# Altium project Spectre-Spectrum-Analyer.PrjPcb
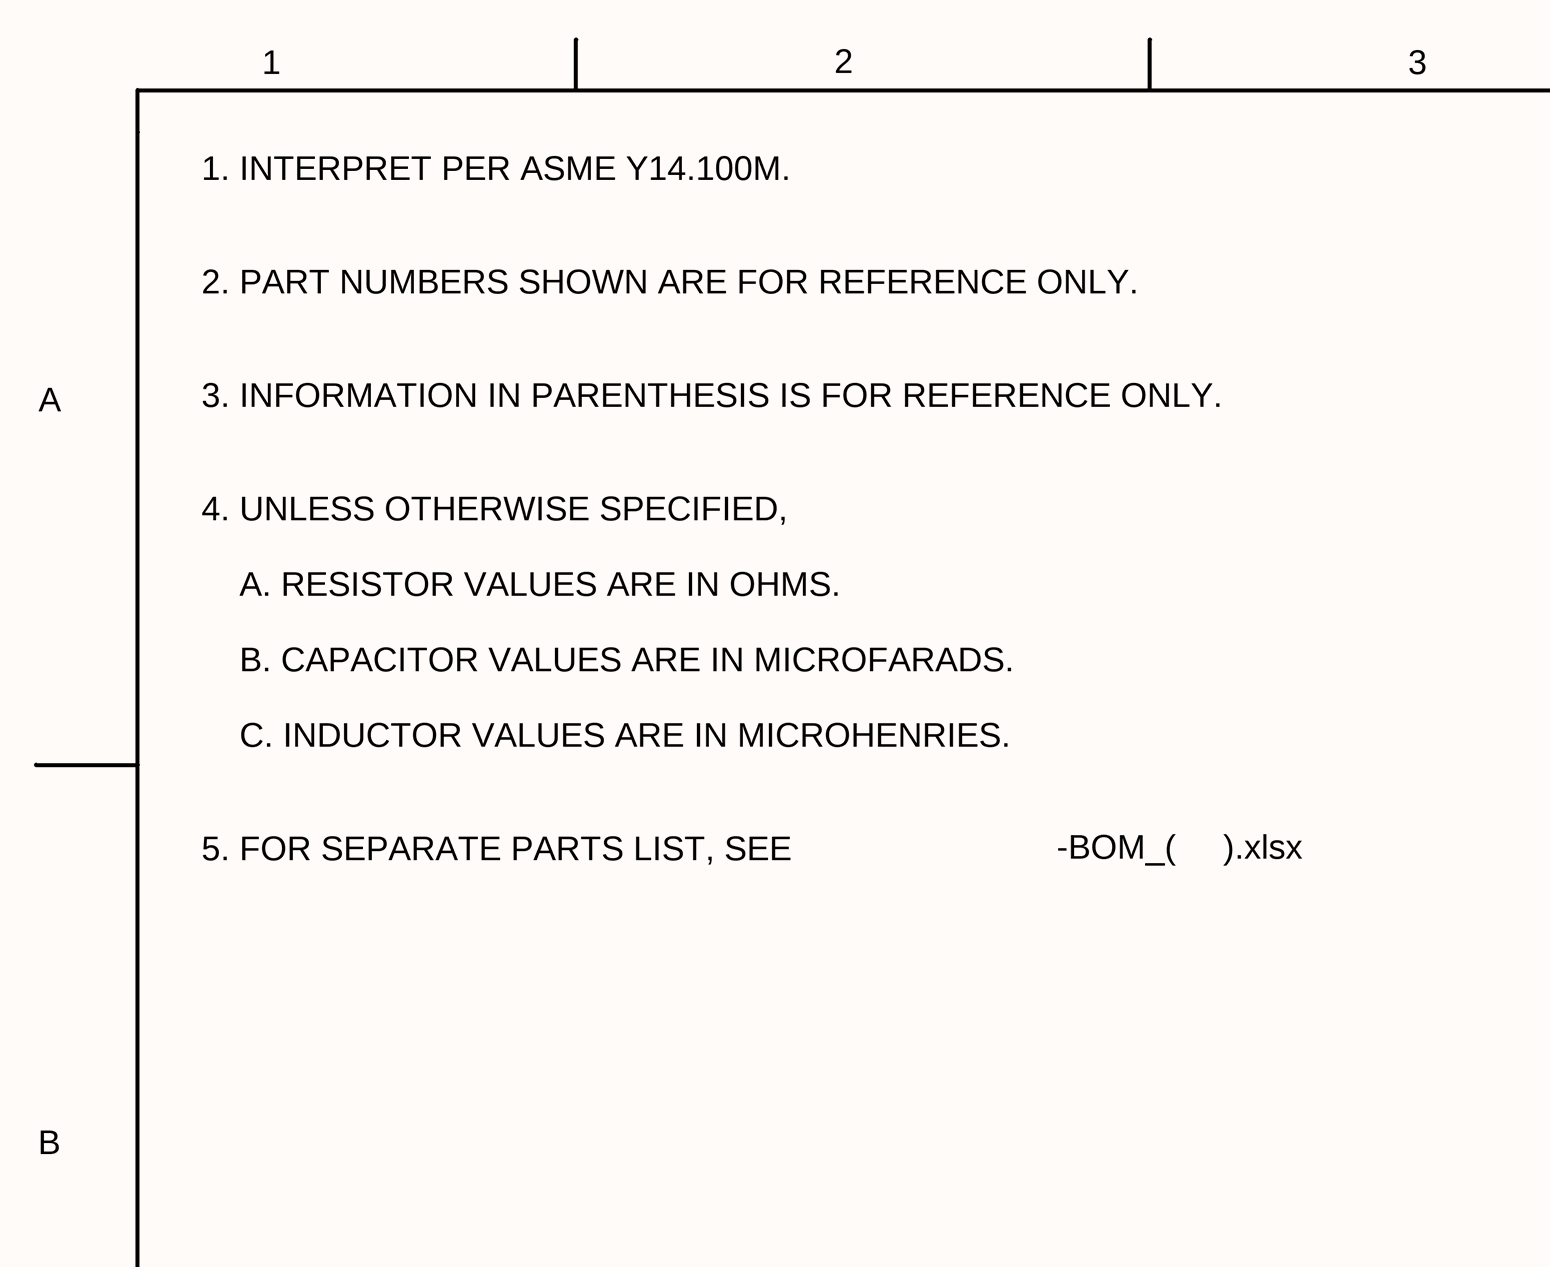
[diagram p0: Spectre-SCH_SH1_(rev).SchDoc, top left]
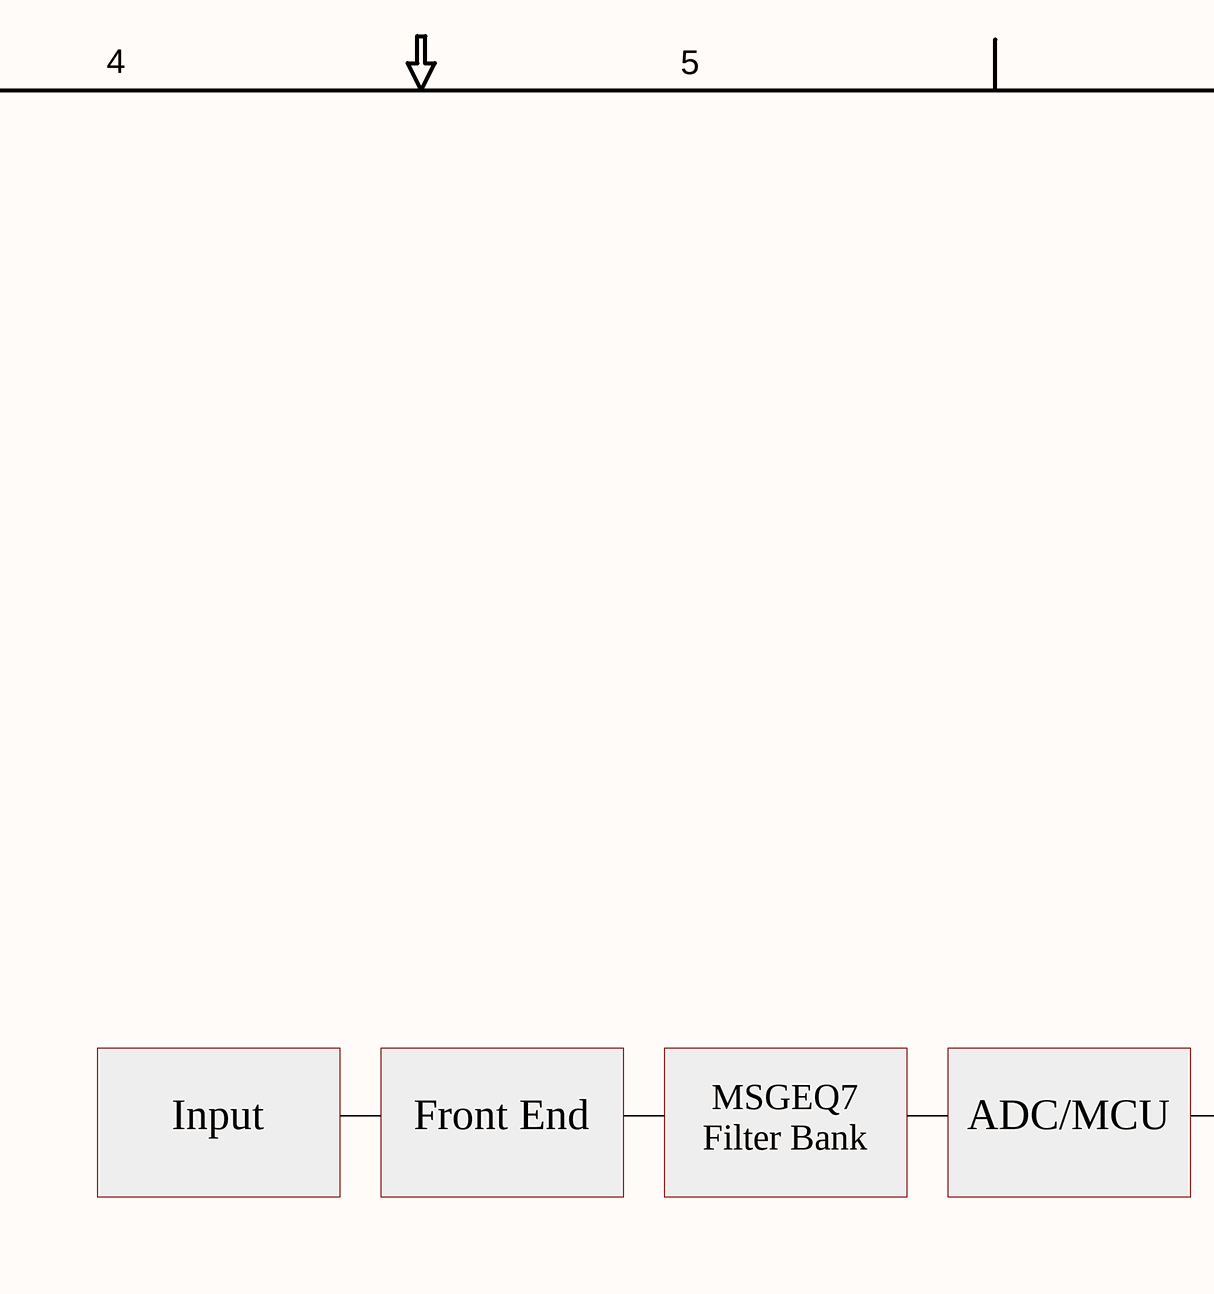
[diagram p1: Spectre-SCH_SH1_(rev).SchDoc, top middle]
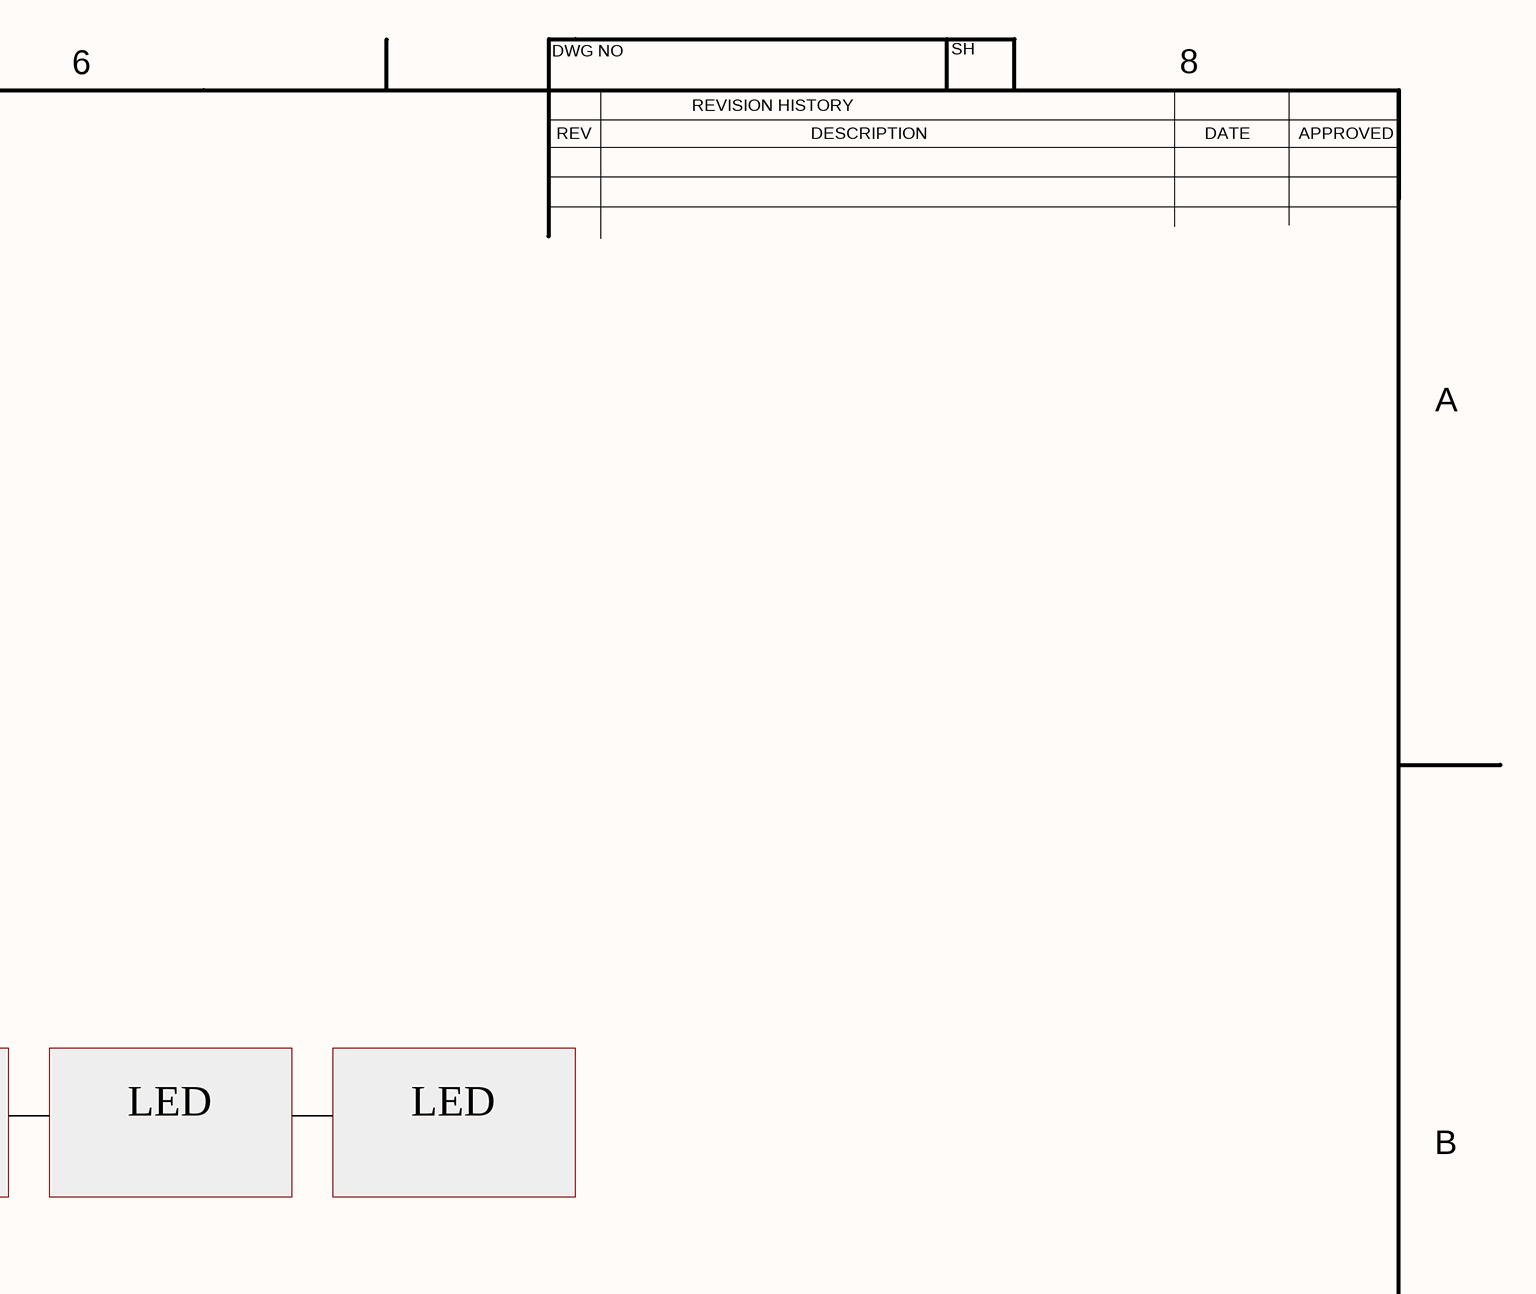
[diagram p2: Spectre-SCH_SH1_(rev).SchDoc, top right]
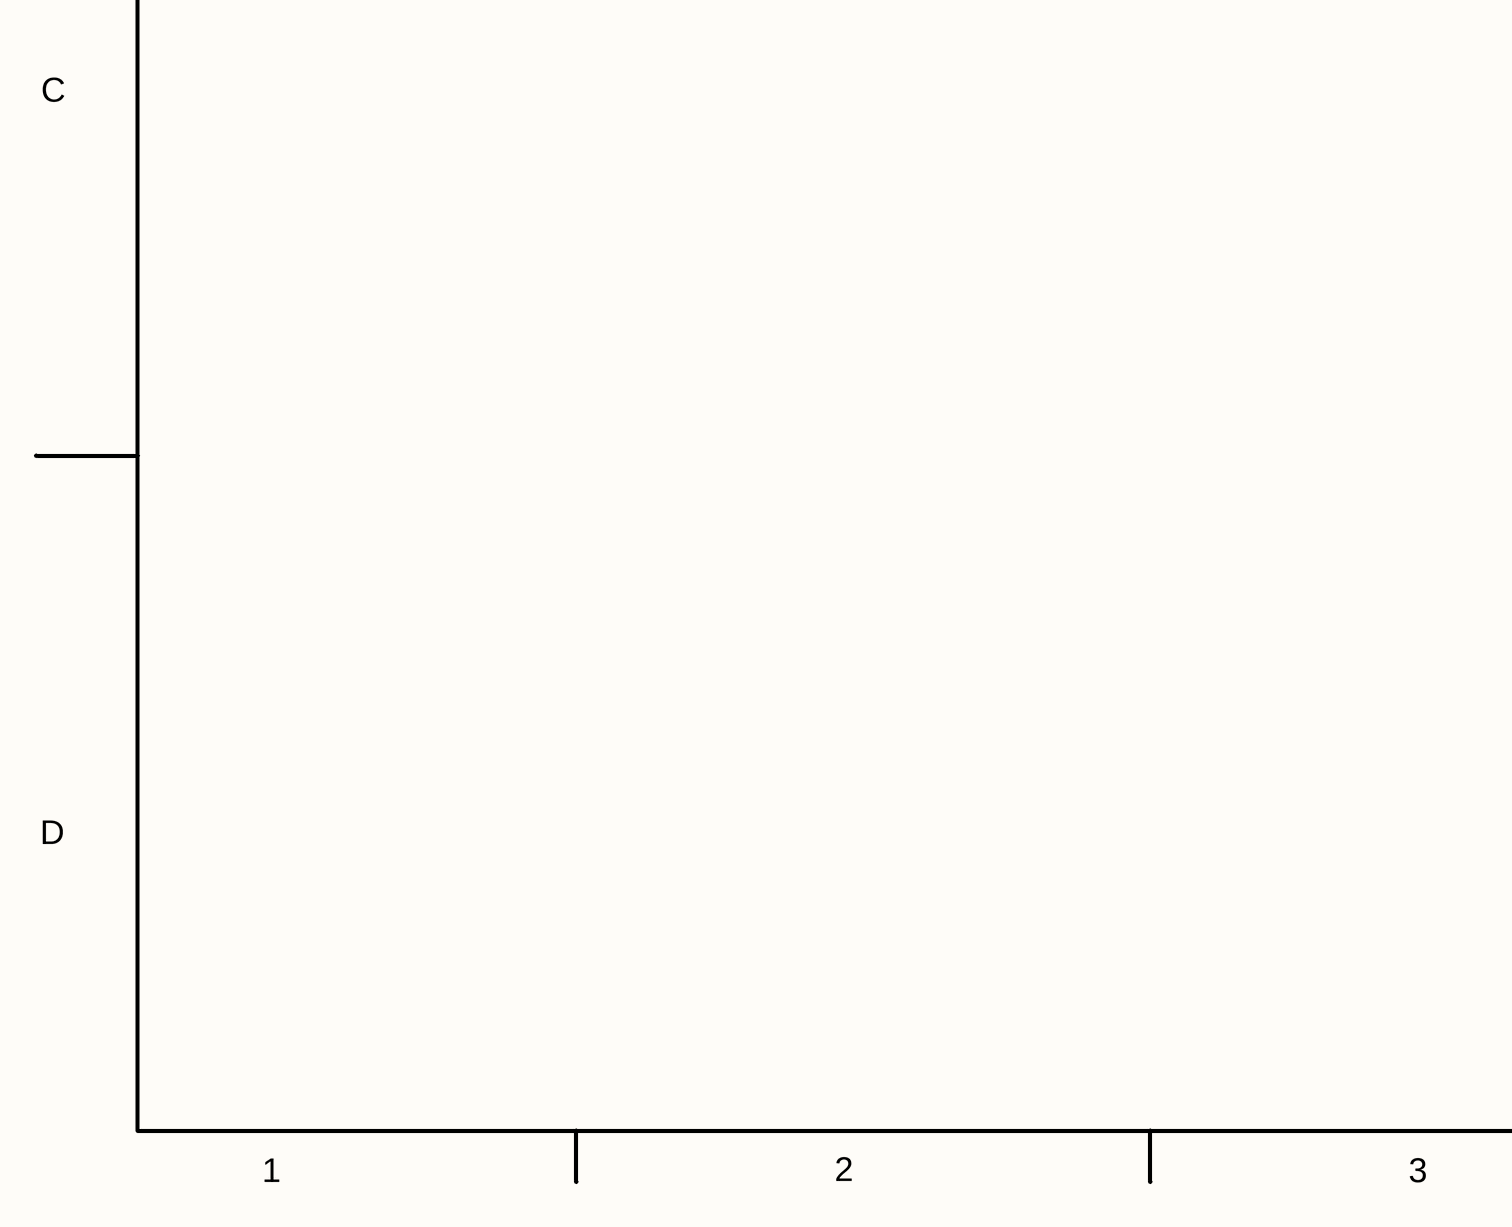
[diagram p3: Spectre-SCH_SH1_(rev).SchDoc, bottom left]
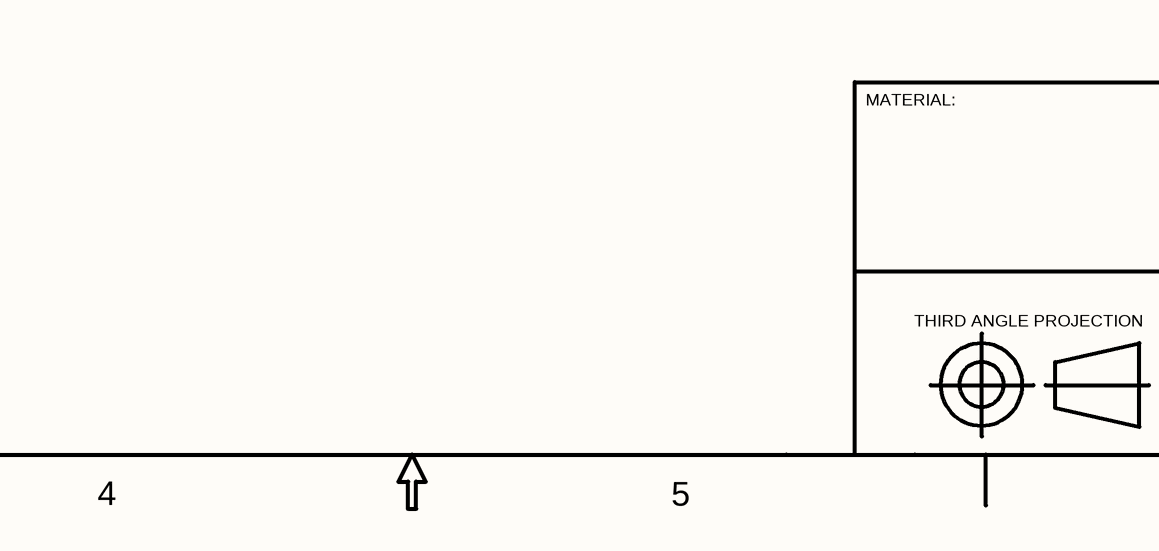
[diagram p4: Spectre-SCH_SH1_(rev).SchDoc, bottom middle]
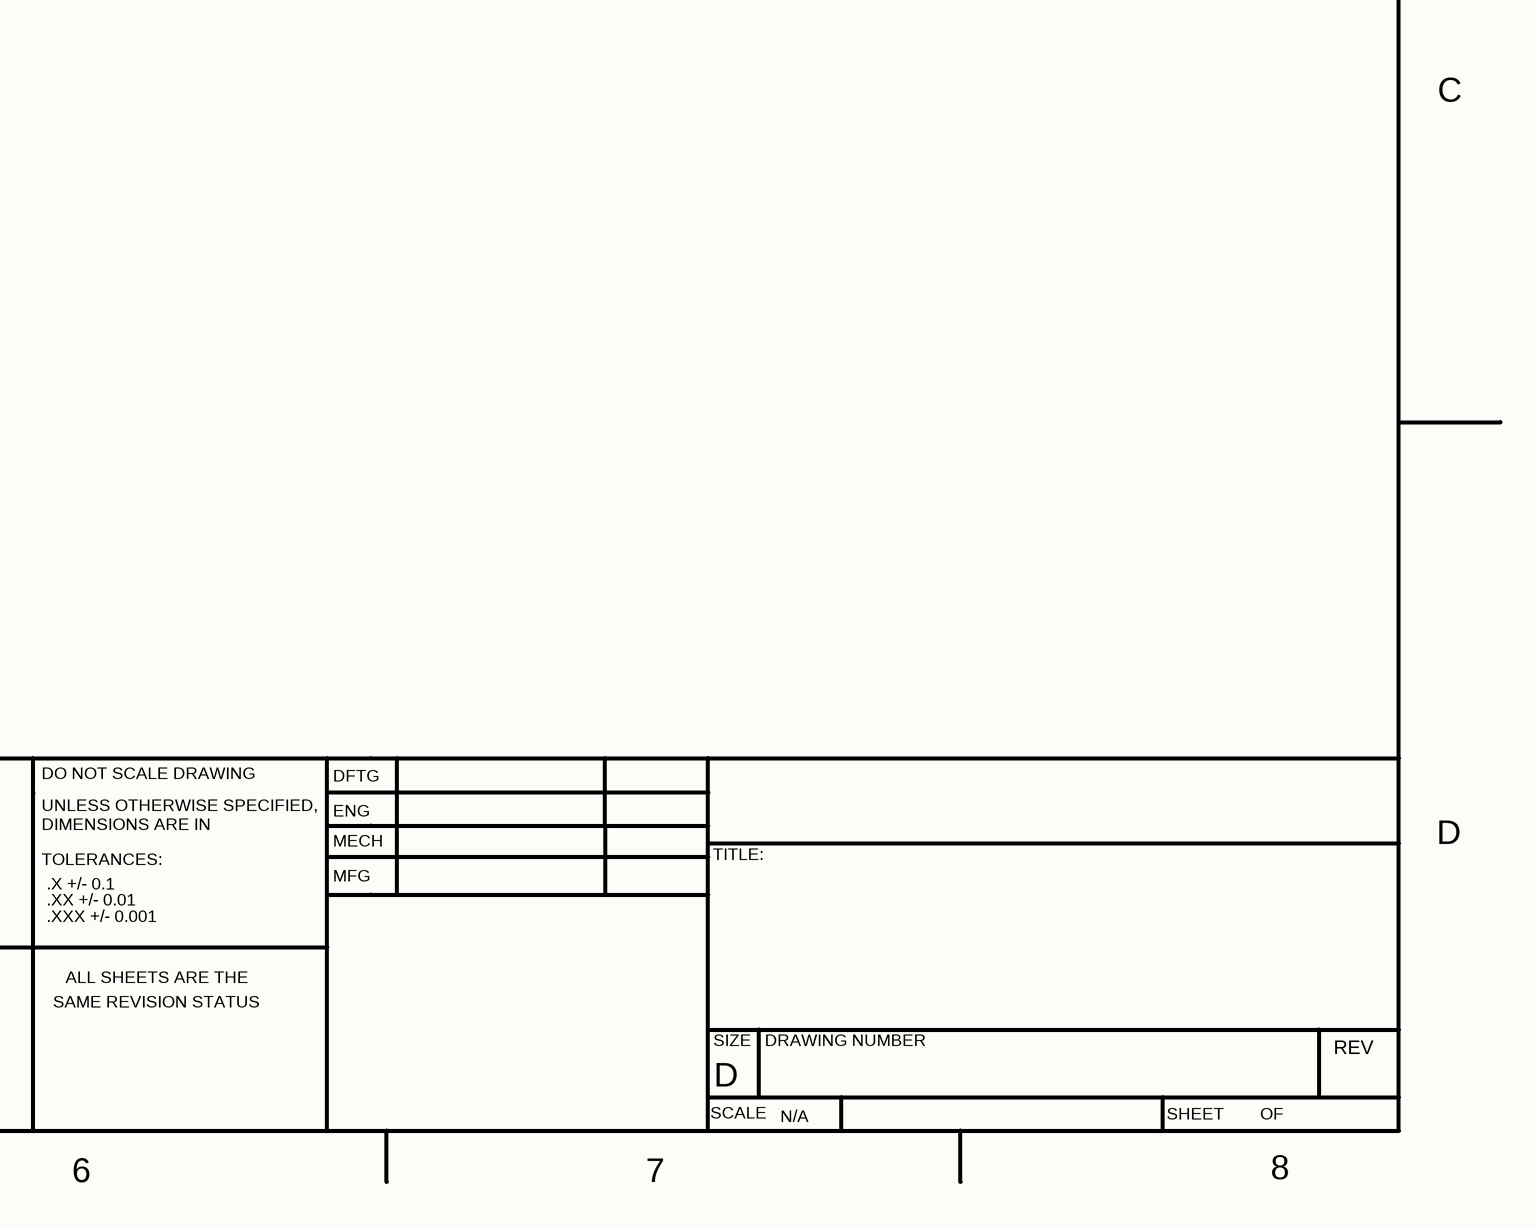
[diagram p5: Spectre-SCH_SH1_(rev).SchDoc, bottom right]
Company: -; DateDftg: -; DateEng: 01/08/22; DocNumber: Spectre; DocNumberPCB: SpectrePCB; Hist1Appr: 11/07/21; Hist1Date: 09/10/21; Hist1Desc: -; Hist1Rev: A; Hist2Appr: -; Hist2Date: -; Hist2Desc: -; Hist2Rev: -; Hist3Appr: -; Hist3Date: -; Hist3Desc: -; Hist3Rev: -; NameDftg: K. KIDD; NameEng: K. KIDD; Rev: B; Title0: Spectre; Title1: Audio Spectrum Analyzer; TitleCCA: CIRCUIT CARD ASSEMBLY,; TitlePCB: PRINTED CIRCUIT BOARD,; TitleSCH: SCHEMATIC, CCA,
2 sheets, 154 parts. Net scope: global (net labels, ports and power ports of the same name join across sheets).
Board file: Spectre.PcbDoc
Sheets:
  Spectre-SCH_SH1_(rev).SchDoc
  Spectre-SCH_SH2_(rev).SchDoc

## Sheet Spectre-SCH_SH1_(rev).SchDoc: SCHEMATIC, CCA,
size 863 x 558 mm; DocumentNumber: XXX-20XXX-XXX; SheetNumber: 1; SheetTotal: 2

### Notes on the sheet
- 1
- 2
- 3
- 4
- 5
- 6
- DWG NO
- REVISION HISTORY
- SH
- 8
- REV
- DESCRIPTION
- DATE
- APPROVED
- A
- -BOM_(
- ).xlsx
- 1. INTERPRET PER ASME Y14.100M.
  2. PART NUMBERS SHOWN ARE FOR REFERENCE ONLY.
  3. INFORMATION IN PARENTHESIS IS FOR REFERENCE ONLY.
  4. UNLESS OTHERWISE SPECIFIED,
  A. RESISTOR VALUES ARE IN OHMS.
  B. CAPACITOR VALUES ARE IN MICROFARADS.
  C. INDUCTOR VALUES ARE IN MICROHENRIES.
  5. FOR SEPARATE PARTS LIST, SEE
- B
- Input
- Front End
- MSGEQ7
  Filter Bank
- ADC/MCU
- LED Driver
- LED Bars
- C
- MATERIAL:
- DO NOT SCALE DRAWING
- UNLESS OTHERWISE SPECIFIED,
- ENG
- DFTG
- D
- DIMENSIONS ARE IN
- TOLERANCES:
- MECH
- MFG
- TITLE:
- .X +/- 0.1
- .XX +/- 0.01
- .XXX +/- 0.001
- THIRD ANGLE PROJECTION
- SAME REVISION STATUS
- ALL SHEETS ARE THE
- SIZE
- DRAWING NUMBER
- SCALE
- N/A
- SHEET        OF
- 7

## Sheet Spectre-SCH_SH2_(rev).SchDoc: SCHEMATIC
size 863 x 558 mm; DocumentNumber: XXX-20XXX-XXX; SheetNumber: 2; SheetTotal: 2; PageSetup: Record=PageOptions|CenterHorizontal=True|CenterVertical=True|PrintScale=0.98|XCorrection=1.00|YCorrection=1.00|PrintKind=2|BorderSize=5000000|LeftOffset=0|BottomOffset=0|Orientation=2|PaperLength=1000|PaperWidth=1000|Scale=100|PaperSource=15|PrintQuality=1200|MediaType=1|DitherType=10|PaperKind=11 x 17|PrintScaleMode=1
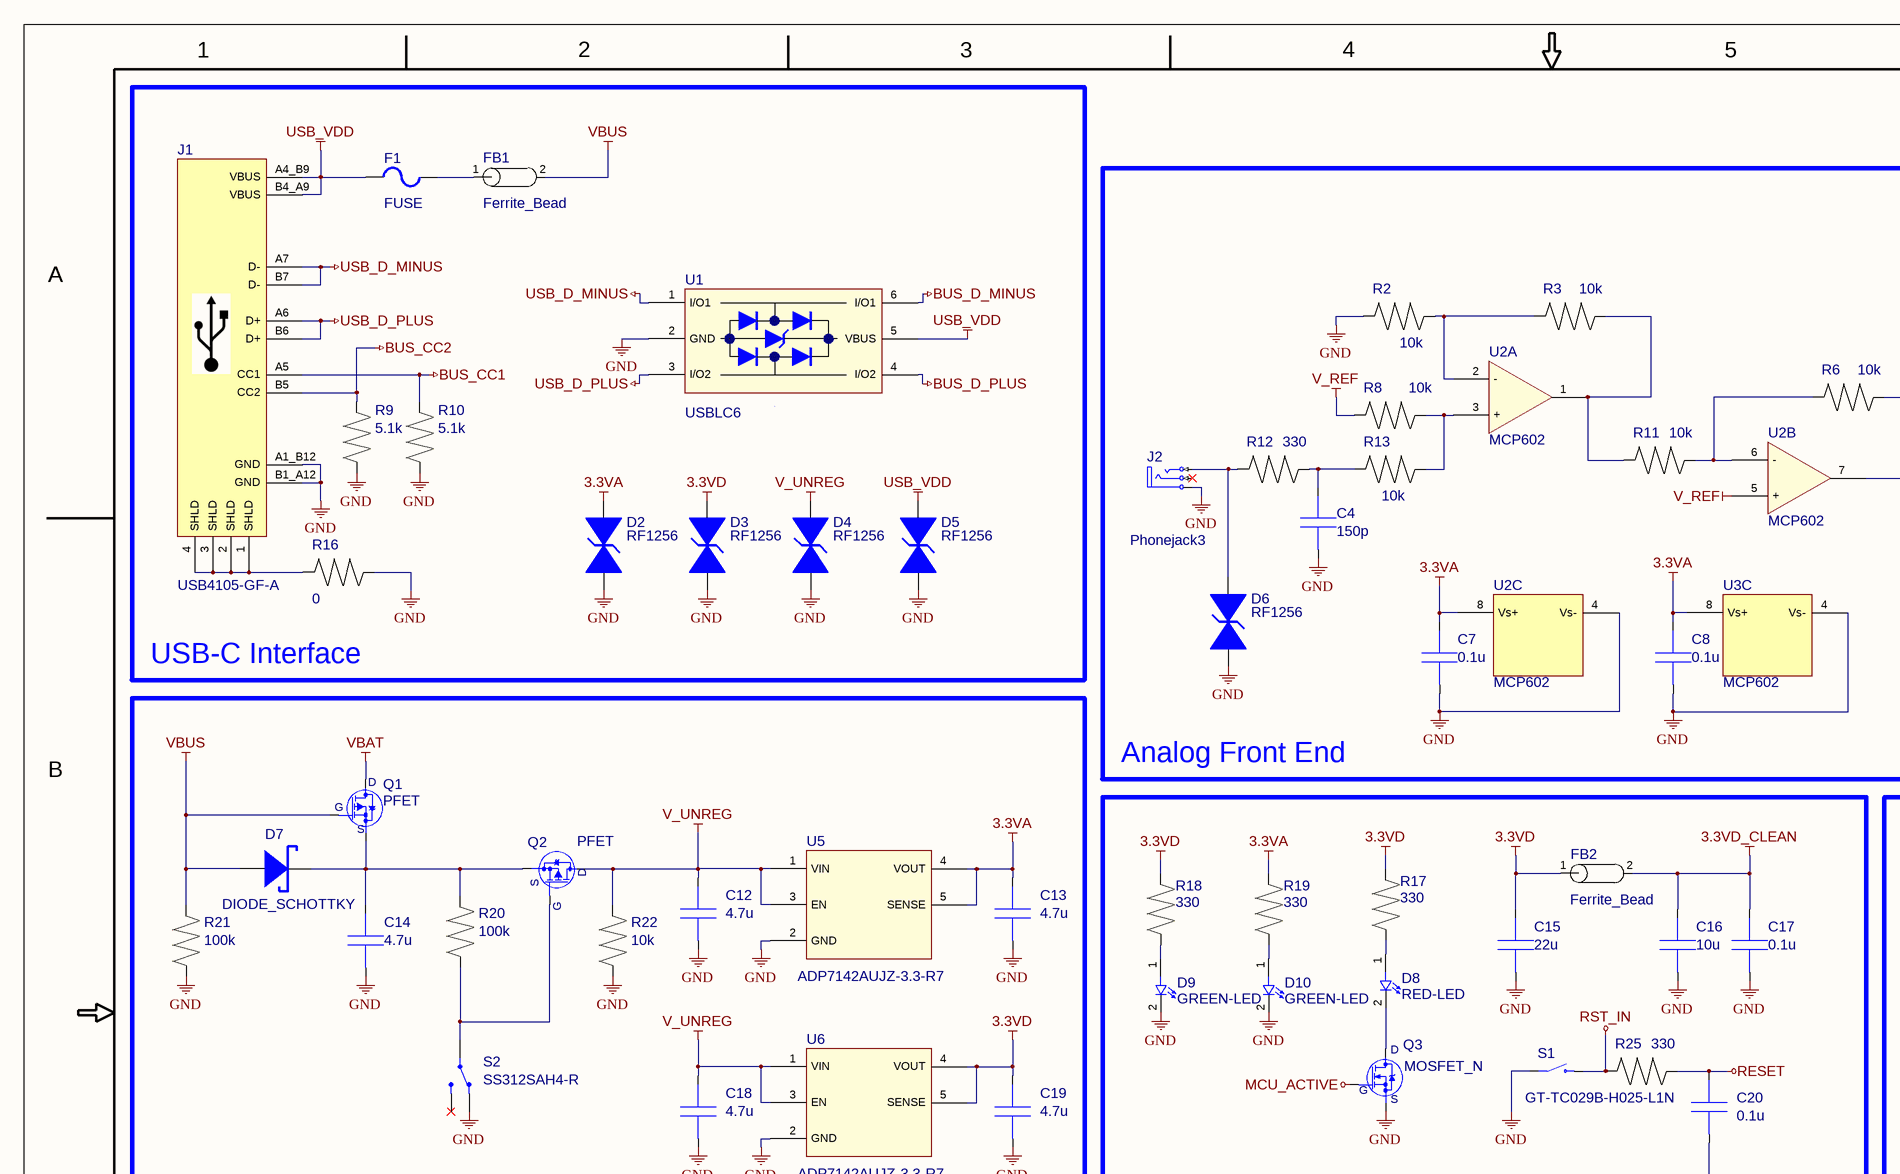
[diagram p6: Spectre-SCH_SH2_(rev).SchDoc, top left]
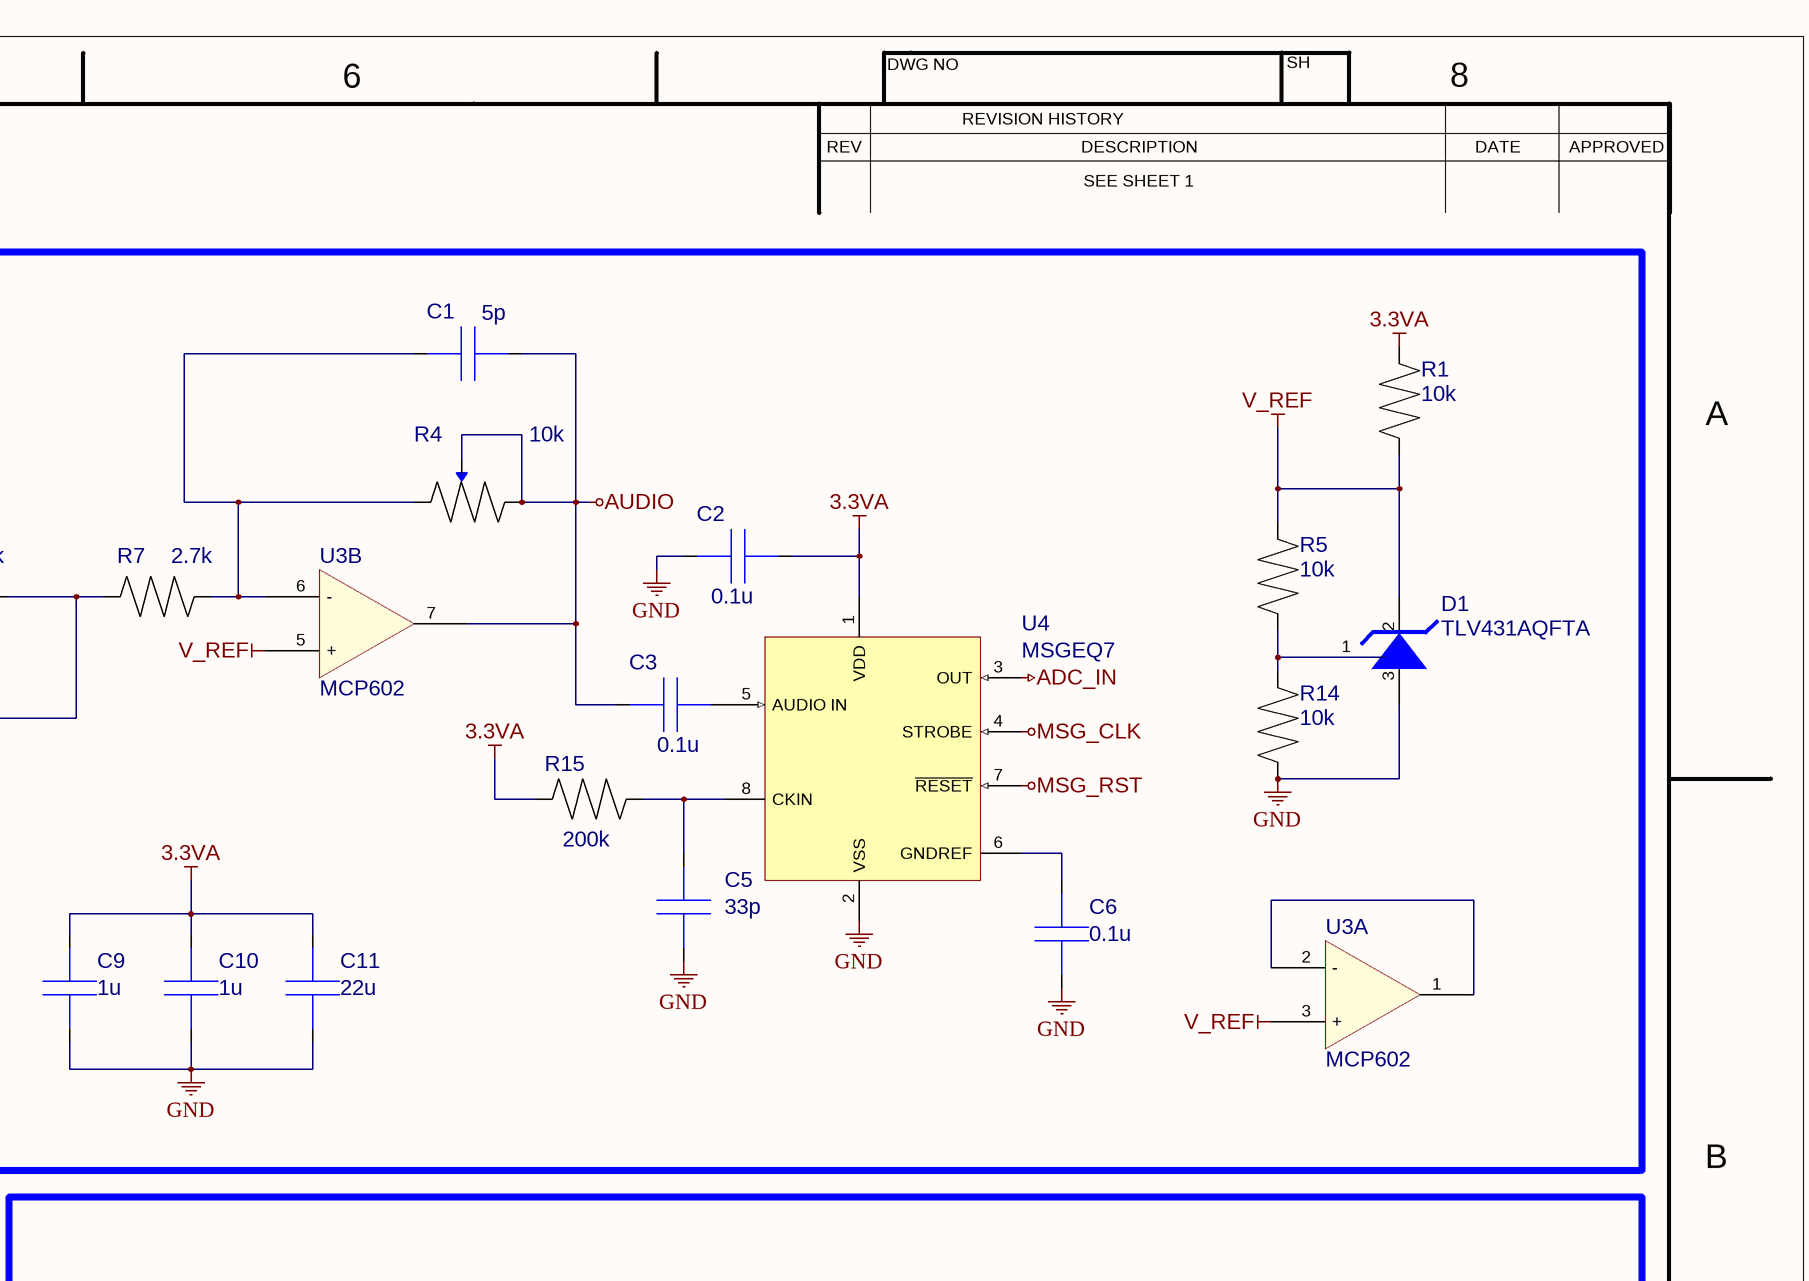
[diagram p7: Spectre-SCH_SH2_(rev).SchDoc, top right]
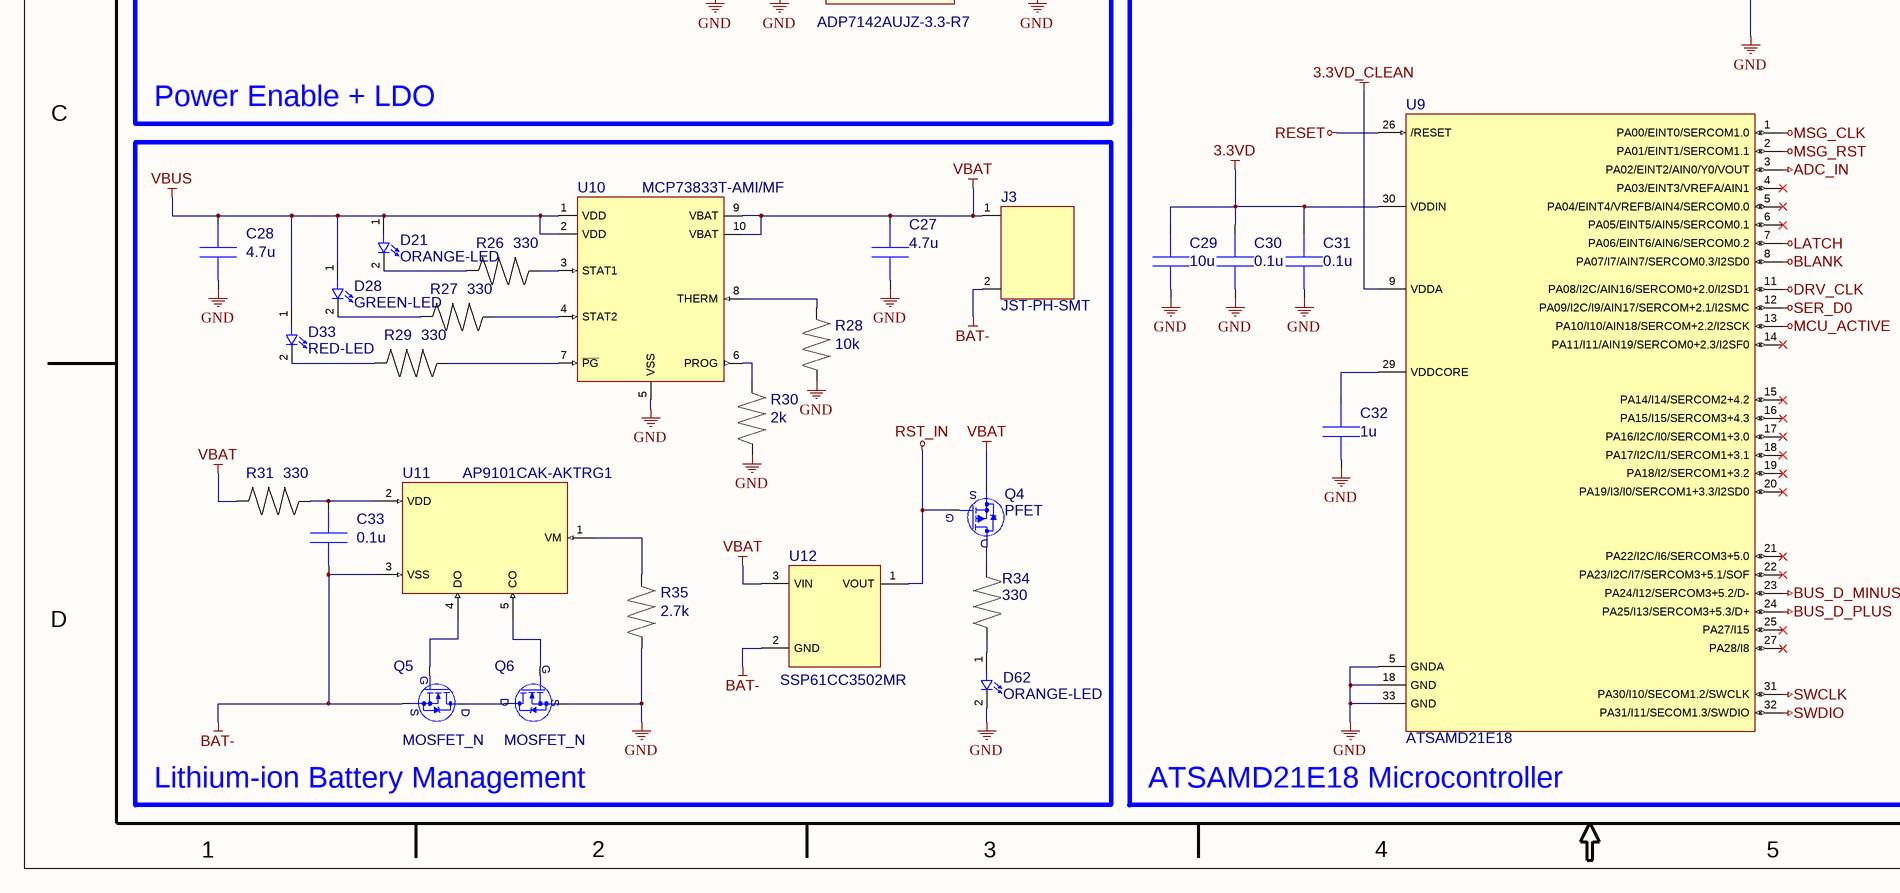
[diagram p8: Spectre-SCH_SH2_(rev).SchDoc, bottom left]
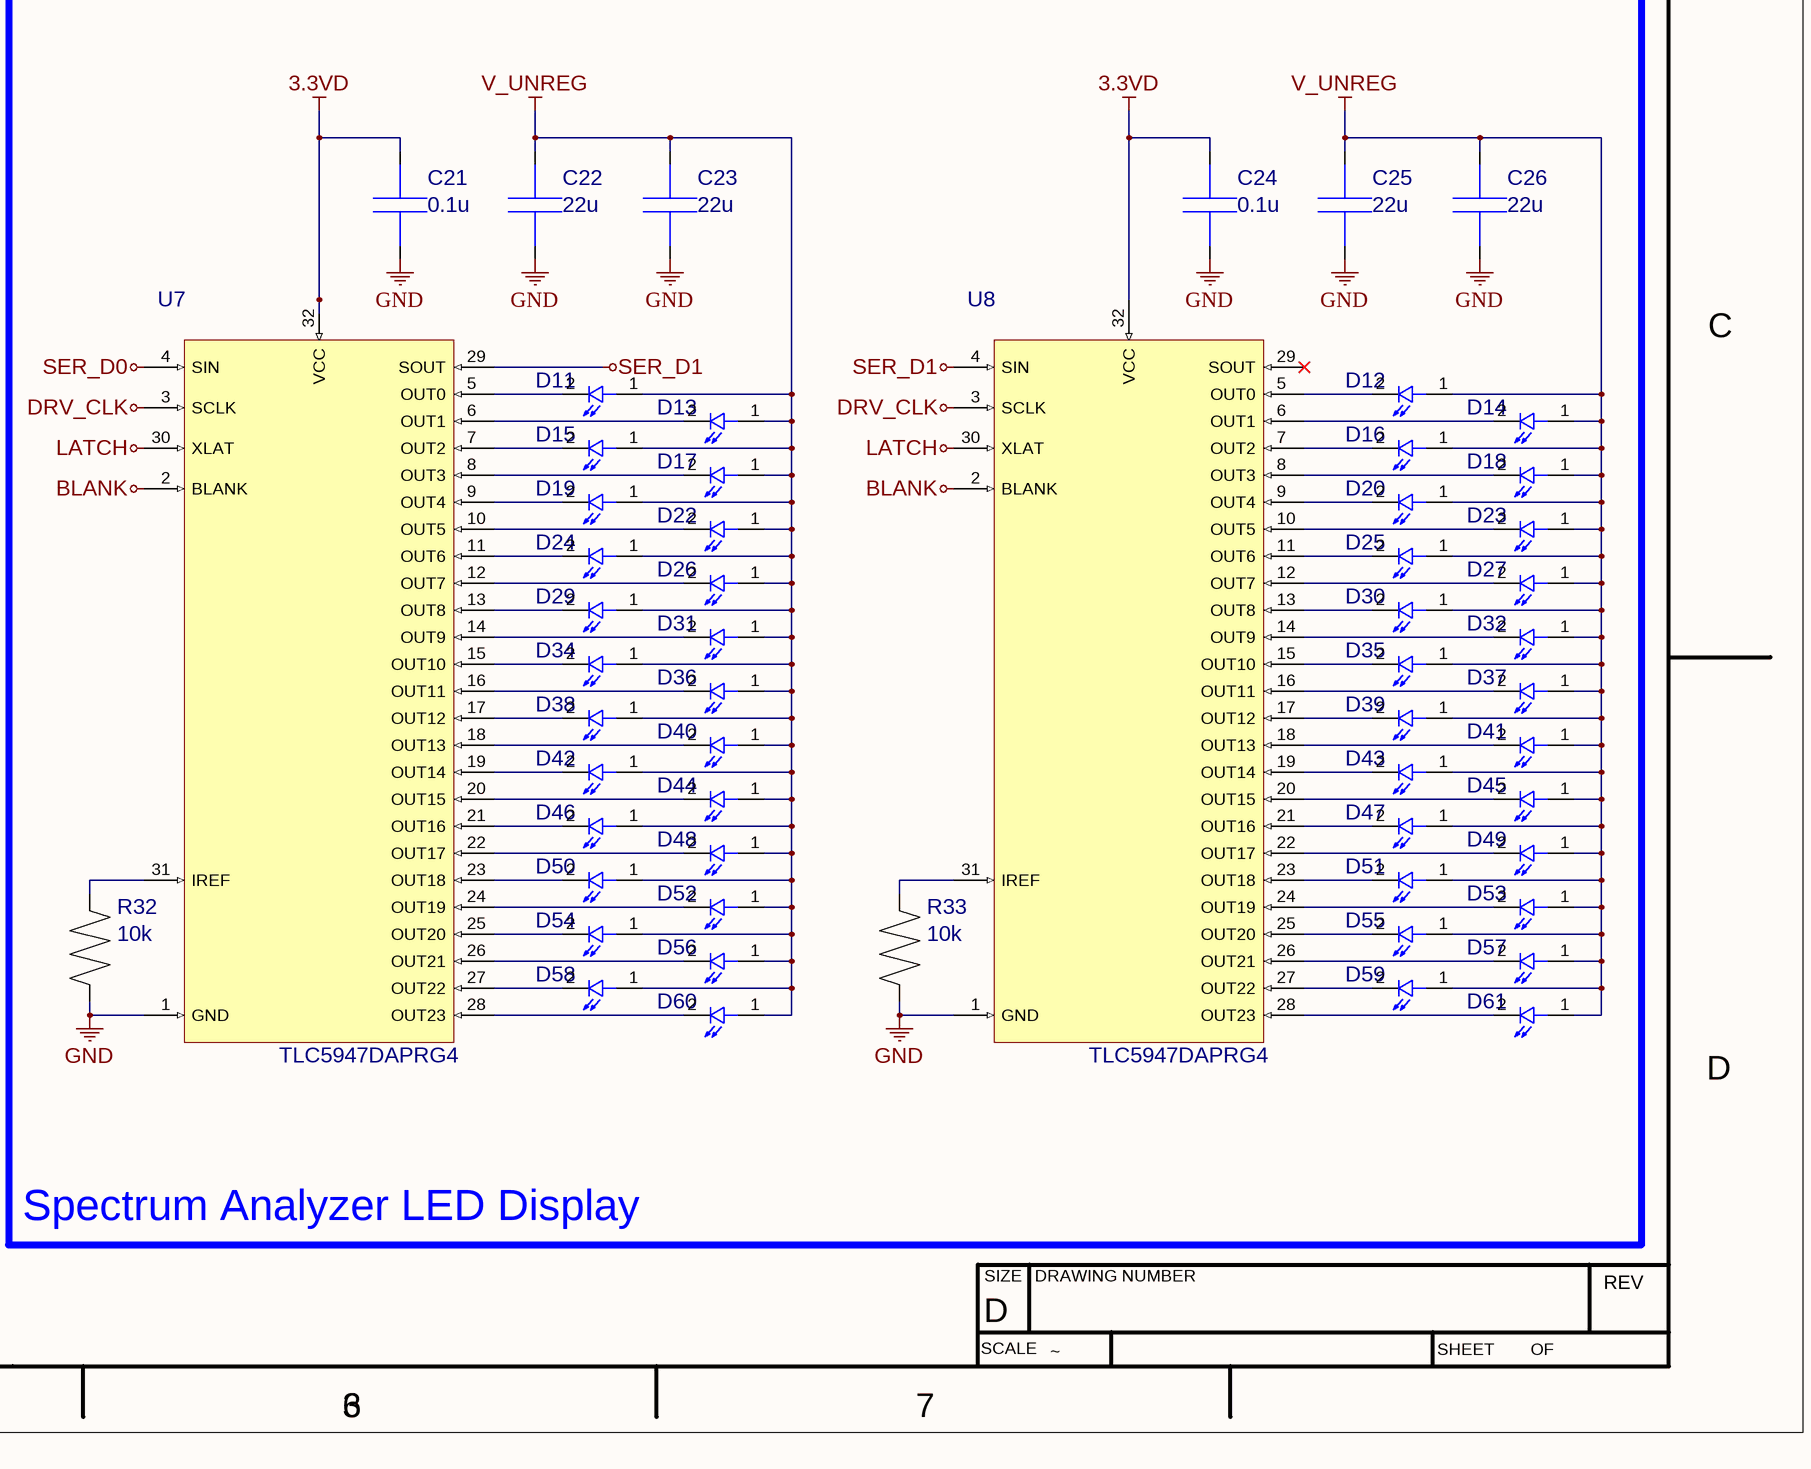
[diagram p9: Spectre-SCH_SH2_(rev).SchDoc, bottom right]

### Parts
C1  5p  [0603]
C2  0.1u  [0603]
C3  0.1u  [0603]
C4  150p  [0603]
C5  33p  [0603]
C6  0.1u  [0603]
C7  0.1u  [0603]
C8  0.1u  [0603]
C9  1u  [0603]
C10  1u  [0603]
C11  22u  [0603]
C12  4.7u  [0603]
C13  4.7u  [0603]
C14  4.7u  [0603]
C15  22u  [0603]
C16  10u  [0603]
C17  0.1u  [0603]
C18  4.7u  [0603]
C19  4.7u  [0603]
C20  0.1u  [0603]
C21  0.1u  [0603]
C22  22u  [0603]
C23  22u  [0603]
C24  0.1u  [0603]
C25  22u  [0603]
C26  22u  [0603]
C27  4.7u  [0603]
C28  4.7u  [0603]
C29  10u  [0603]
C30  0.1u  [0603]
C31  0.1u  [0603]
C32  1u  [0603]
C33  0.1u  [0603]
D1  TLV431AQFTA  [SOT-23-3]
D2  RF1256  [0603]
D3  RF1256  [0603]
D4  RF1256  [0603]
D5  RF1256  [0603]
D6  RF1256  [0603]
D7  DIODE_SCHOTTKY  [SMA]
D8  RED-LED  [0603 LED]
D9  GREEN-LED  [0603 LED]
D10  GREEN-LED  [0603 LED]
D11  RED-LED  [0603 LED]  (value not drawn)
D12  RED-LED  [0603 LED]  (value not drawn)
D13  ORANGE-LED  [0603 LED]  (value not drawn)
D14  ORANGE-LED  [0603 LED]  (value not drawn)
D15  YELLOW-LED  [0603 LED]  (value not drawn)
D16  YELLOW-LED  [0603 LED]  (value not drawn)
D17  YELLOW-LED  [0603 LED]  (value not drawn)
D18  YELLOW-LED  [0603 LED]  (value not drawn)
D19  GREEN-LED  [0603 LED]  (value not drawn)
D20  GREEN-LED  [0603 LED]  (value not drawn)
D21  ORANGE-LED  [0603 LED]
D22  GREEN-LED  [0603 LED]  (value not drawn)
D23  GREEN-LED  [0603 LED]  (value not drawn)
D24  RED-LED  [0603 LED]  (value not drawn)
D25  RED-LED  [0603 LED]  (value not drawn)
D26  ORANGE-LED  [0603 LED]  (value not drawn)
D27  ORANGE-LED  [0603 LED]  (value not drawn)
D28  GREEN-LED  [0603 LED]
D29  YELLOW-LED  [0603 LED]  (value not drawn)
D30  YELLOW-LED  [0603 LED]  (value not drawn)
D31  YELLOW-LED  [0603 LED]  (value not drawn)
D32  YELLOW-LED  [0603 LED]  (value not drawn)
D33  RED-LED  [0603 LED]
D34  GREEN-LED  [0603 LED]  (value not drawn)
D35  GREEN-LED  [0603 LED]  (value not drawn)
D36  GREEN-LED  [0603 LED]  (value not drawn)
D37  GREEN-LED  [0603 LED]  (value not drawn)
D38  GREEN-LED  [0603 LED]  (value not drawn)
D39  RED-LED  [0603 LED]  (value not drawn)
D40  GREEN-LED  [0603 LED]  (value not drawn)
D41  ORANGE-LED  [0603 LED]  (value not drawn)
D42  YELLOW-LED  [0603 LED]  (value not drawn)
D43  YELLOW-LED  [0603 LED]  (value not drawn)
D44  YELLOW-LED  [0603 LED]  (value not drawn)
D45  YELLOW-LED  [0603 LED]  (value not drawn)
D46  ORANGE-LED  [0603 LED]  (value not drawn)
D47  GREEN-LED  [0603 LED]  (value not drawn)
D48  RED-LED  [0603 LED]  (value not drawn)
D49  GREEN-LED  [0603 LED]  (value not drawn)
D50  GREEN-LED  [0603 LED]  (value not drawn)
D51  GREEN-LED  [0603 LED]  (value not drawn)
D52  GREEN-LED  [0603 LED]  (value not drawn)
D53  GREEN-LED  [0603 LED]  (value not drawn)
D54  YELLOW-LED  [0603 LED]  (value not drawn)
D55  YELLOW-LED  [0603 LED]  (value not drawn)
D56  RED-LED  [0603 LED]  (value not drawn)
D57  YELLOW-LED  [0603 LED]  (value not drawn)
D58  ORANGE-LED  [0603 LED]  (value not drawn)
D59  ORANGE-LED  [0603 LED]  (value not drawn)
D60  YELLOW-LED  [0603 LED]  (value not drawn)
D61  RED-LED  [0603 LED]  (value not drawn)
D62  ORANGE-LED  [0603 LED]
F1  FUSE  [1206]
FB1  Ferrite_Bead  [0603]
FB2  Ferrite_Bead  [0603]
J1  USB4105-GF-A  [USB4105-GF-A]
J2  Phonejack3  [STX-3500-3NTR]
J3  JST-PH-SMT  [JST-PH-SMT]
Q1  PFET  [TO-252-3]
Q2  PFET  [TO-252-3]
Q3  MOSFET_N  [SOT-23]
Q4  PFET  [SOT-23]
Q5  MOSFET_N  [SOT-23]
Q6  MOSFET_N  [SOT-23]
R1  10k  [0603]
R2  10k  [0603]
R3  10k  [0603]
R4  10k  [ALPS 9mm]
R5  10k  [0603]
R6  10k  [0603]
R7  2.7k  [0603]
R8  10k  [0603]
R9  5.1k  [0603]
R10  5.1k  [0603]
R11  10k  [0603]
R12  330  [0603]
R13  10k  [0603]
R14  10k  [0603]
R15  200k  [0603]
R16  0  [0603]
R17  330  [0603]
R18  330  [0603]
R19  330  [0603]
R20  100k  [0603]
R21  100k  [0603]
R22  10k  [0603]
R25  330  [0603]
R26  330  [0603]
R27  330  [0603]
R28  10k  [0603]
R29  330  [0603]
R30  2k  [0603]
R31  330  [0603]
R32  10k  [0603]
R33  10k  [0603]
R34  330  [0603]
R35  2.7k  [0603]
S1  GT-TC029B-H025-L1N  [GT-TC029B-H025-L1N]
S2  SS312SAH4-R  [SW_SS312SAH4-R]
U1  USBLC6  [SOT-23-6_N]
U2  MCP602  [MSOP-8]  (parts A,B,C of 3)
U3  MCP602  [MSOP-8]  (parts A,B,C of 3)
U4  MSGEQ7  [MSGEQ7]
U5  ADP7142AUJZ-3.3-R7  [TSOT-23-5]
U6  ADP7142AUJZ-3.3-R7  [TSOT-23-5]
U7  TLC5947DAPRG4  [*SOP65P810X120-32N]
U8  TLC5947DAPRG4  [*SOP65P810X120-32N]
U9  ATSAMD21E18  [QFN-32 Handsolder]
U10  MCP73833T-AMI/MF  [MSOP-10]
U11  AP9101CAK-AKTRG1  [SOT-23-5]
U12  SSP61CC3502MR  [SOT-23-3]

### Blocks framed on the sheet
USB-C Interface: D2-D5 F1 FB1 J1 R9 R10 R16 U1
Analog Front End: C1-C11 D1 D6 J2 R1-R8 R11-R15 U2-U4
Power Enable + LDO: C12-C14 C18 C19 D7 Q1 Q2 R20-R22 S2 U5 U6
ATSAMD21E18 Microcontroller: C15-C17 C20 C29-C32 D8-D10 FB2 Q3 R17-R19 R25 S1 U9
Spectrum Analyzer LED Display: C21-C26 D11-D20 D22-D27 D29-D32 D34-D61 R32 R33 U7 U8
Lithium-ion Battery Management: C27 C28 C33 D21 D28 D33 D62 J3 Q4-Q6 R26-R31 R34 R35 U10-U12

### Nets
3.3VA: C2.1 C7.2 C8.2 C9.2 C10.2 C11.2 C13.2 D2.2 R1.1 R15.2 R19.2 U2.8(Vs+) U3.8(Vs+) U4.1(VDD) U5.4(VOUT) U5.5(SENSE)
3.3VD: C15.2 C19.2 C21.2 C24.2 C29.2 C30.2 C31.2 D3.2 FB2.1 R17.2 R18.2 U6.4(VOUT) U6.5(SENSE) U7.32(VCC) U8.32(VCC) U9.30(VDDIN)
3.3VD_CLEAN: C16.2 C17.2 FB2.2 U9.9(VDDA)
ADC_IN: U4.3(OUT) U9.3(PA02/EINT2/AIN0/Y0/VOUT)
AUDIO: C1.1 C3.2 R4.2 R4.3 U3.7(OUT)
BAT-: C33.1 J3.2 Q5.3(S) U11.3(VSS) U12.2(GND)
BLANK: U7.2(BLANK) U8.2(BLANK) U9.8(PA07/I7/AIN7/SERCOM0.3/I2SD0)
BUS_CC1: J1.A5(CC1) R10.2
BUS_CC2: J1.B5(CC2) R9.2
BUS_D_MINUS: U1.6(I/O1) U9.23(PA24/I12/SERCOM3+5.2/D-)
BUS_D_PLUS: U1.4(I/O2) U9.24(PA25/I13/SERCOM3+5.3/D+)
DRV_CLK: U7.3(SCLK) U8.3(SCLK) U9.11(PA08/I2C/AIN16/SERCOM0+2.0/I2SD1)
GND: C2.2 C4.1 C5.2 C6.2 C7.1 C8.1 C9.1 C10.1 C11.1 C12.1 C13.1 C14.1 C15.1 C16.1 C17.1 C18.1 C19.1 C20.1 C21.1 C22.1 C23.1 C24.1 C25.1 C26.1 C27.1 C28.1 C29.1 C30.1 C31.1 C32.1 D1.3(A) D2.1 D3.1 D4.1 D5.1 D6.1 D9.2 D10.2 D62.2 J1.A1_B12(GND) J1.B1_A12(GND) J2.1(S) Q3.3(S) Q6.3(S) R2.2 R9.1 R10.1 R14.2 R16.1 R21.1 R22.1 R28.2 R30.2 R32.1 R33.1 R35.2 S1.1 S2.1 U1.2(GND) U2.4(Vs-) U3.4(Vs-) U4.2(VSS) U5.2(GND) U6.2(GND) U7.1(GND) U8.1(GND) U9.5(GNDA) U9.18(GND) U9.33(GND) U10.5(VSS)
LATCH: U7.30(XLAT) U8.30(XLAT) U9.7(PA06/EINT6/AIN6/SERCOM0.2)
MCU_ACTIVE: Q3.1(G) U9.13(PA10/I10/AIN18/SERCOM+2.2/I2SCK)
MSG_CLK: U4.4(STROBE) U9.1(PA00/EINT0/SERCOM1.0)
MSG_RST: U4.7(~{RESET}) U9.2(PA01/EINT1/SERCOM1.1)
RESET: C20.2 R25.1 U9.26(/RESET)
RST_IN: Q4.1(G) R25.2 S1.2 U12.1(VOUT)
SER_D0: U7.4(SIN) U9.12(PA09/I2C/I9/AIN17/SERCOM+2.1/I2SMC)
SER_D1: U7.29(SOUT) U8.4(SIN)
SWCLK: U9.31(PA30/I10/SECOM1.2/SWCLK)
SWDIO: U9.32(PA31/I11/SECOM1.3/SWDIO)
USB_D_MINUS: J1.A7(D-) J1.B7(D-) U1.1(I/O1)
USB_D_PLUS: J1.A6(D+) J1.B6(D+) U1.3(I/O2)
USB_VDD: D5.2 F1.1 J1.A4_B9(VBUS) J1.B4_A9(VBUS) U1.5(VBUS)
V_REF: D1.2(K) R1.2 R5.1 R8.2 U2.5(+) U3.3(+) U3.5(+)
V_UNREG: C12.2 C18.2 C22.2 C23.2 C25.2 C26.2 D4.2 D11.1 D12.1 D13.1 D14.1 D15.1 D16.1 D17.1 D18.1 D19.1 D20.1 D22.1 D23.1 D24.1 D25.1 D26.1 D27.1 D29.1 D30.1 D31.1 D32.1 D34.1 D35.1 D36.1 D37.1 D38.1 D39.1 D40.1 D41.1 D42.1 D43.1 D44.1 D45.1 D46.1 D47.1 D48.1 D49.1 D50.1 D51.1 D52.1 D53.1 D54.1 D55.1 D56.1 D57.1 D58.1 D59.1 D60.1 D61.1 Q2.2(D) R22.2 U5.1(VIN) U5.3(EN) U6.1(VIN) U6.3(EN)
VBAT: C27.2 J3.1 Q1.2(D) Q4.3(S) R31.2 U10.9(VBAT) U10.10(VBAT) U12.3(VIN)
VBUS: C28.2 D7.1(A) D21.1 D28.1 D33.1 FB1.2 Q1.1(G) R21.2 U10.1(VDD) U10.2(VDD)
NetC1_2: C1.2 R4.1 R7.1 U3.6(-)
NetC3_1: C3.1 U4.5(AUDIO_IN)
NetC4_2: C4.2 R12.1 R13.2
NetC5_1: C5.1 R15.1 U4.8(CKIN)
NetC6_1: C6.1 U4.6(GNDREF)
NetC14_2: C14.2 D7.2(K) Q1.3(S) Q2.3(S) R20.2
NetC32_2: C32.2 U9.29(VDDCORE)
NetC33_2: C33.2 R31.1 U11.2(VDD)
NetD1_1: D1.1(REF) R5.2 R14.1
NetD6_2: D6.2 J2.3(T) R12.2
NetD8_1: D8.1 R17.1
NetD8_2: D8.2 Q3.2(D)
NetD9_1: D9.1 R18.1
NetD10_1: D10.1 R19.1
NetD11_2: D11.2 U7.5(OUT0)
NetD12_2: D12.2 U8.5(OUT0)
NetD13_2: D13.2 U7.6(OUT1)
NetD14_2: D14.2 U8.6(OUT1)
NetD15_2: D15.2 U7.7(OUT2)
NetD16_2: D16.2 U8.7(OUT2)
NetD17_2: D17.2 U7.8(OUT3)
NetD18_2: D18.2 U8.8(OUT3)
NetD19_2: D19.2 U7.9(OUT4)
NetD20_2: D20.2 U8.9(OUT4)
NetD21_2: D21.2 R26.2
NetD22_2: D22.2 U7.10(OUT5)
NetD23_2: D23.2 U8.10(OUT5)
NetD24_2: D24.2 U7.11(OUT6)
NetD25_2: D25.2 U8.11(OUT6)
NetD26_2: D26.2 U7.12(OUT7)
NetD27_2: D27.2 U8.12(OUT7)
NetD28_2: D28.2 R27.2
NetD29_2: D29.2 U7.13(OUT8)
NetD30_2: D30.2 U8.13(OUT8)
NetD31_2: D31.2 U7.14(OUT9)
NetD32_2: D32.2 U8.14(OUT9)
NetD33_2: D33.2 R29.2
NetD34_2: D34.2 U7.15(OUT10)
NetD35_2: D35.2 U8.15(OUT10)
NetD36_2: D36.2 U7.16(OUT11)
NetD37_2: D37.2 U8.16(OUT11)
NetD38_2: D38.2 U7.17(OUT12)
NetD39_2: D39.2 U8.17(OUT12)
NetD40_2: D40.2 U7.18(OUT13)
NetD41_2: D41.2 U8.18(OUT13)
NetD42_2: D42.2 U7.19(OUT14)
NetD43_2: D43.2 U8.19(OUT14)
NetD44_2: D44.2 U7.20(OUT15)
NetD45_2: D45.2 U8.20(OUT15)
NetD46_2: D46.2 U7.21(OUT16)
NetD47_2: D47.2 U8.21(OUT16)
NetD48_2: D48.2 U7.22(OUT17)
NetD49_2: D49.2 U8.22(OUT17)
NetD50_2: D50.2 U7.23(OUT18)
NetD51_2: D51.2 U8.23(OUT18)
NetD52_2: D52.2 U7.24(OUT19)
NetD53_2: D53.2 U8.24(OUT19)
NetD54_2: D54.2 U7.25(OUT20)
NetD55_2: D55.2 U8.25(OUT20)
NetD56_2: D56.2 U7.26(OUT21)
NetD57_2: D57.2 U8.26(OUT21)
NetD58_2: D58.2 U7.27(OUT22)
NetD59_2: D59.2 U8.27(OUT22)
NetD60_2: D60.2 U7.28(OUT23)
NetD61_2: D61.2 U8.28(OUT23)
NetD62_1: D62.1 R34.1
NetF1_2: F1.2 FB1.1
NetJ1_1: J1.1(SHLD) J1.2(SHLD) J1.3(SHLD) J1.4(SHLD) R16.2
NetQ2_1: Q2.1(G) R20.1 S2.2
NetQ4_2: Q4.2(D) R34.2
NetQ5_1: Q5.1(G) U11.4(DO)
NetQ5_2: Q5.2(D) Q6.2(D)
NetQ6_1: Q6.1(G) U11.5(CO)
NetR2_1: R2.1 R3.2 U2.2(-)
NetR3_1: R3.1 R11.2 U2.1(OUT)
NetR6_1: R6.1 R7.2 U2.7(OUT)
NetR6_2: R6.2 R11.1 U2.6(-)
NetR8_1: R8.1 R13.1 U2.3(+)
NetR26_1: R26.1 U10.3(STAT1)
NetR27_1: R27.1 U10.4(STAT2)
NetR28_1: R28.1 U10.8(THERM)
NetR29_1: R29.1 U10.7(~{PG})
NetR30_1: R30.1 U10.6(PROG)
NetR32_2: R32.2 U7.31(IREF)
NetR33_2: R33.2 U8.31(IREF)
NetR35_1: R35.1 U11.1(VM)
NetU3_1: U3.1(OUT) U3.2(-)

Not connected (* = marked no-connect by the designer): J2 2(R)*; S2 3*; U8 29(SOUT)*; U9 4(PA03/EINT3/VREFA/AIN1)* 6(PA05/EINT5/AIN5/SERCOM0.1)* 14(PA11/I11/AIN19/SERCOM0+2.3/I2SF0)* 15(PA14/I14/SERCOM2+4.2)* 16(PA15/I15/SERCOM3+4.3)* 17(PA16/I2C/I0/SERCOM1+3.0)* 19(PA18/I2/SERCOM1+3.2)* 20(PA19/I3/I0/SERCOM1+3.3/I2SD0)* 21(PA22/I2C/I6/SERCOM3+5.0)* 22(PA23/I2C/I7/SERCOM3+5.1/SOF)* 25(PA27/I15)* 27(PA28/I8)*

### Notes on the sheet
- 1
- 2
- 3
- 4
- 5
- 6
- DWG NO
- REVISION HISTORY
- SH
- 8
- REV
- DESCRIPTION
- SEE SHEET 1
- DATE
- APPROVED
- A
- B
- C
- D
- SIZE
- DRAWING NUMBER
- SCALE
- ~
- SHEET        OF
- 7

### Library data of the parts
C1-C33 = CAP: Part Number: *; Manufacturer: *
D1 = TLV431AQFTA: Shunt Voltage Reference IC Adjustable 1.24V 18 VV ±1% 15 mA SOT-23-3; Manufacturer: Diodes Incorporated; Part Number: TLV431AQFTA
D2-D6 = DIODE_TVS_BIDIR: TVS DIODE BIDIR; Manufacturer: *; Part Number: *
D7 = DIODE_SCHOTTKY: DIODE SCHOTTKY; Manufacturer: *; Part Number: *
D8-D62 = SMT-LED
FB1 FB2 = Ferrite_Bead: Ferrite Bead; Manufacturer: *; Part Number: *
J1 = USB4105-GF-A: USB-C (USB TYPE-C) USB 2.0 Receptacle Connector 24 (16+8 Dummy) Position Surface Mount, Right Angle; Through Hole; Manufacturer: GCT; Part Number: USB4105-GF-A
J2 = Phonejack3: Jack Socket, 1/4" [6.5mm], Thru-Hole, Vertical, 3-Conductor Open Circuit (Non-Normalling); PackageDocument: 2003; PCB_Layout: Complies with manufacturer's recommendation.; DrillAndSlotSize: Corresponds to nominal value.; Published: 15-Jul-2004; LatestRevisionDate: 15-Jul-2004; LatestRevisionNote: Component Replaced.; DatasheetDocument: 2003; PackageReference: S1VS_SSS; Publisher: Altium Limited; ComponentLink1Description: Manufacturer Link; ComponentLink1URL: http://www.cliffuk.co.uk/
Q1 Q2 Q4 = MOSFET_P: MOSFET, P CH, 3-PIN; Manufacturer: *; Part Number: *
Q3 Q5 Q6 = MOSFET_N: MOSFET, N CH, 3-PIN; Part Number: *; Manufacturer: *
R1-R3 R5-R22 R25-R35 = RES: RESISTOR; Part Number: *; Manufacturer: *
R4 = Adafruit 356: 10 kOhms - PC Pin Through Hole Trimmer Potentiometer - Turn Top Adjustment; Manufacturer: Adafruit Industries LLC; Part Number: 356
S2 = SS312SAH4-R: Slide Switch SPDT Surface Mount, Right Angle; Manufacturer: NKK Switches; Part Number: SS312SAH4-R
U1 = USBLC6-2SC6: IC ESD PROTECTION LO CAP SOT23-6; Manufacturer: STMicroelectronics; Part Number: USBLC6-2SC6
U2 U3 = AD8072: IC OPAMP VIDEO DUAL 8MSOP; Part Number: AD8072ARMZ; Manufacturer: Analog Devices Inc.
U10 = MCP73833T-AMI/MF: Charger IC Lithium Ion/Polymer 10-DFN _3x3_; MF: Microchip; MP: MCP73833T-AMI/MF; Availability: Unavailable; SnapEDA_Link: https://www.snapeda.com/parts/MCP73833T-AMI/MF/Microchip/view-part/1192592/?ref=snap; Package: DFN-10 Microchip; Price: None; Value: *
U12 = SSP61C
F1 = FUSE: Part Number: *; Manufacturer: *
U7 U8 = TLC5947DAPRG4: Value: *